# Altium schematic sheet Duplexer.SchDoc
size A4
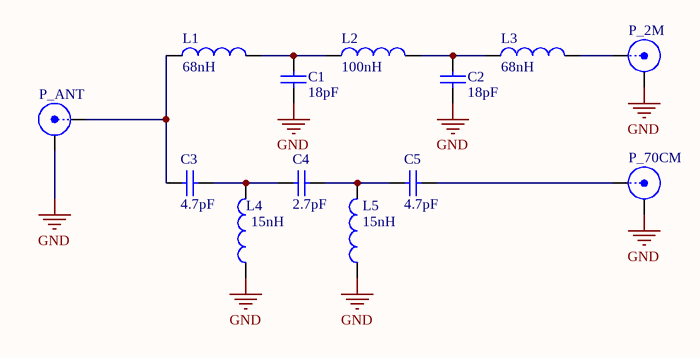
[diagram p0: Duplexer.SchDoc]

## Parts
C1  value 18pF  [6-0805_N]  (hidden comment: Cap Semi)
C2  value 18pF  [6-0805_N]  (hidden comment: Cap Semi)
C3  value 4.7pF  [6-0805_N]  (hidden comment: Cap Semi)
C4  value 2.7pF  [6-0805_N]  (hidden comment: Cap Semi)
C5  value 4.7pF  [6-0805_N]  (hidden comment: Cap Semi)
L1  value 68nH  [6-0805_N]  (hidden comment: Inductor)
L2  value 100nH  [6-0805_N]  (hidden comment: Inductor)
L3  value 68nH  [6-0805_N]  (hidden comment: Inductor)
L4  value 15nH  [6-0805_N]  (hidden comment: Inductor)
L5  value 15nH  [6-0805_N]  (hidden comment: Inductor)
P_2M  SMB  [SMB_V-RJ45]  (value not drawn)
P_70CM  SMB  [SMB_V-RJ45]  (value not drawn)
P_ANT  SMB  [SMB_V-RJ45]  (value not drawn)

## Nets
GND: C1.1 C2.1 L4.1 L5.1 P_2M.2(Y) P_70CM.2(Y) P_ANT.2(Y)
NetC1_2: C1.2 L1.2 L2.1
NetC2_2: C2.2 L2.2 L3.1
NetC3_1: C3.1 C4.2 L4.2
NetC3_2: C3.2 L1.1 P_ANT.1(X)
NetC4_1: C4.1 C5.2 L5.2
NetC5_1: C5.1 P_70CM.1(X)
NetL3_2: L3.2 P_2M.1(X)

## Library data of the parts
C1-C5 = Cap Semi: Capacitor (Semiconductor SIM Model); Published: 8-Jun-2000; LatestRevisionDate: 29-May-2009; LatestRevisionNote: IPC-7351 Footprint Added.; PackageReference: C1206; Publisher: Altium Limited; PackageDescription: Chip Capacitor
L1-L5 = Inductor: Code_IEC: 1005; Published: 8-Jun-2000; LatestRevisionDate: 29-May-2009; LatestRevisionNote: IPC-7351 Footprint Added.; PackageReference: 0402-A; Publisher: Altium Limited; PackageDescription: Chip Inductor; Code_JEITA: 0402
P_2M P_70CM P_ANT = SMB: SMB Straight Connector; LatestRevisionDate: 17-Jul-2002; LatestRevisionNote: Re-released for DXP Platform.; Publisher: Altium Limited